# Altium schematic sheet USB.SchDoc
size A4
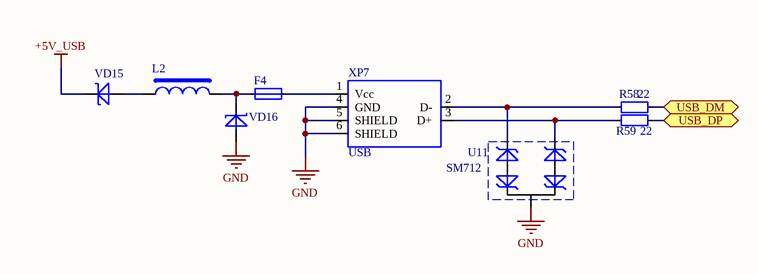
[diagram p0: USB.SchDoc]

## Parts
F4  (no value)  [SMD_1206]
L2  (no value)  [INDC4516AM]
R58  22  [SMD_0805]
R59  22  [SMD_0805]
U11  SM712  [SOT23-3]
VD15  (no value)  [SOD-123]
VD16  (no value)  [SOD-123]
XP7  USB  [USB/SM0.8-6H5]

## Ports
USB_DM (bidir), USB_DP (bidir)

## Nets
+5V_USB: VD15.1(C)
GND: U11.3 VD16.2(A) XP7.4(GND) XP7.5(SHIELD) XP7.6(SHIELD)
USB_DM: R58.1 ; port USB_DM
USB_DP: R59.1 ; port USB_DP
NetF4_1: F4.1 XP7.1(Vcc)
NetF4_2: F4.2 L2.2 VD16.1(C)
NetL2_1: L2.1 VD15.2(A)
NetR58_2: R58.2 U11.1 XP7.2(D-)
NetR59_2: R59.2 U11.2 XP7.3(D+)

## Library data of the parts
F4 = FUSE: Resistor; Case: 1206
L2 = FB: Ferrite Bread; Case: INDC4516AM
R58 R59 = RES: Resistor; Value: 22; Case: *
U11 = SM712: TVS diodes
VD15 VD16 = ZENER: Zener diode; Case: SOD-123